# Altium schematic sheet fpga_gpif.SchDoc
size A3
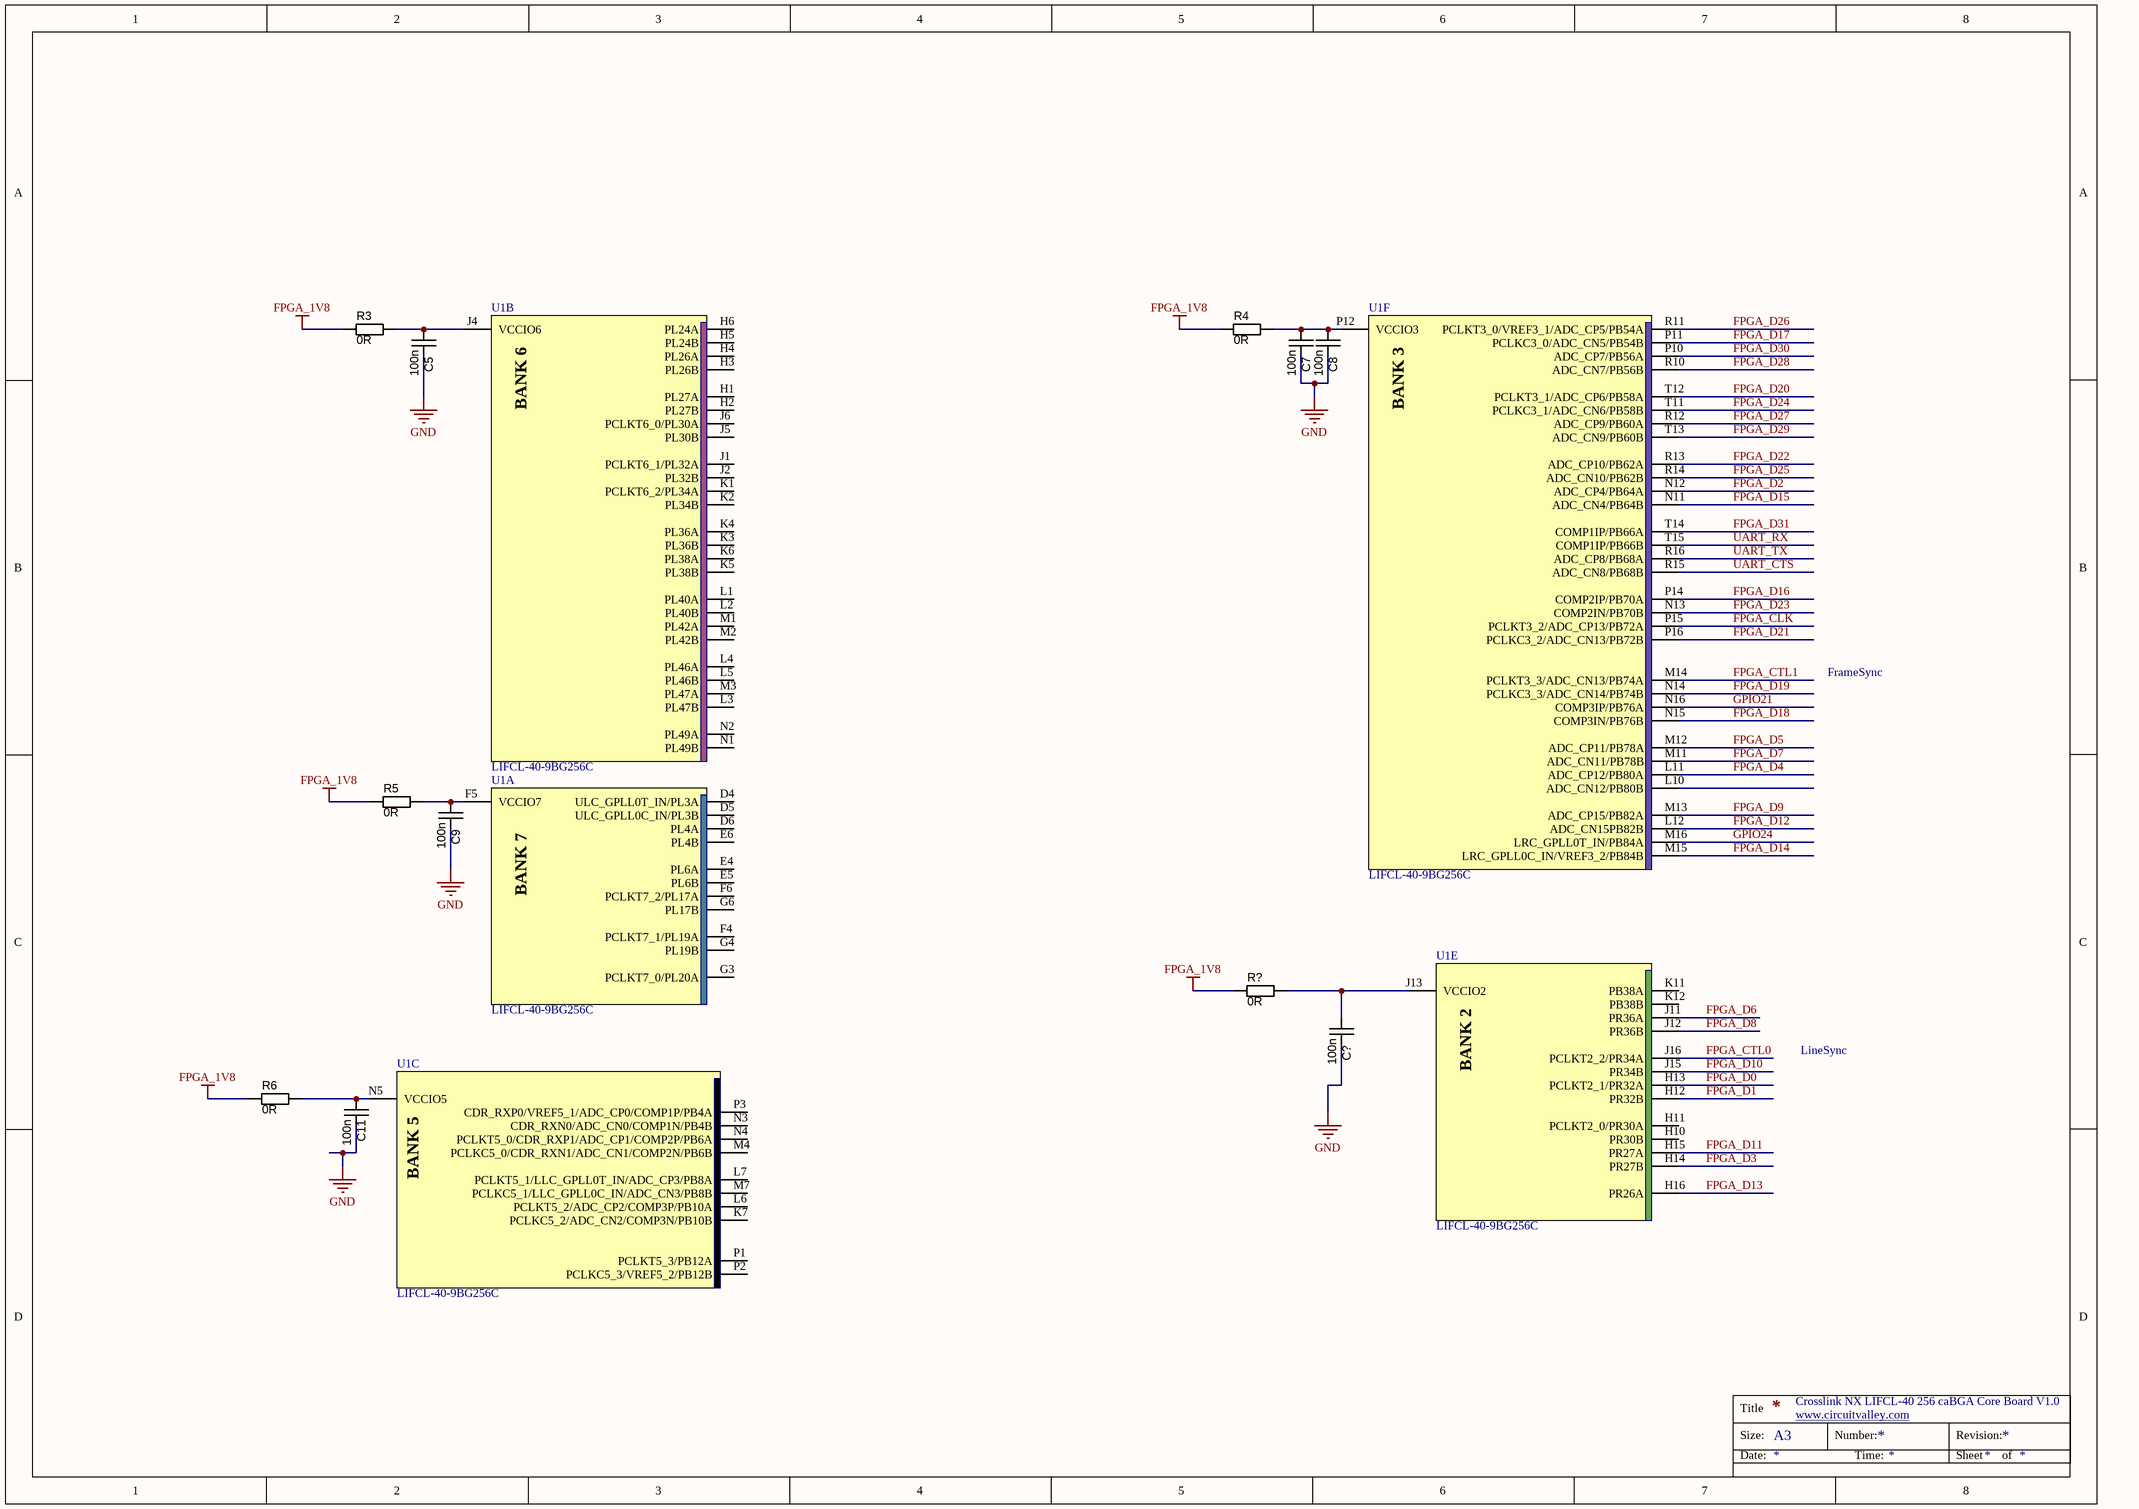
[diagram p0: fpga_gpif.SchDoc]

## Parts
C5  100n  [CAPC1005N]
C7  100n  [CAPC1005N]
C8  100n  [CAPC1005N]
C9  100n  [CAPC1005N]
C11  100n  [CAPC1005N]
C?  100n  [CAPC1005N]
R3  value 0R  [RESC1005N]  (hidden comment: Thick Film)
R4  value 0R  [RESC1005N]  (hidden comment: Thick Film)
R5  value 0R  [RESC1005N]  (hidden comment: Thick Film)
R6  value 0R  [RESC1005N]  (hidden comment: Thick Film)
R?  value 0R  [RESC1005N]  (hidden comment: Thick Film)
U1  LIFCL-40-9BG256C  [Lattice_256_CABGA]  (parts A,B,C,E,F of 14)

## Nets
FPGA_1V8: R3.1 R4.1 R5.1 R6.1 R?.1
GND: C5.1 C7.1 C8.1 C9.1 C11.1 C?.1
FPGA_CLK: U1.P15(PCLKT3_2/ADC_CP13/PB72A)
FPGA_CTL0: U1.J16(PCLKT2_2/PR34A)
FPGA_CTL1: U1.M14(PCLKT3_3/ADC_CN13/PB74A)
FPGA_D0: U1.H13(PCLKT2_1/PR32A)
FPGA_D1: U1.H12(PR32B)
FPGA_D2: U1.N12(ADC_CP4/PB64A)
FPGA_D3: U1.H14(PR27B)
FPGA_D4: U1.L11(ADC_CP12/PB80A)
FPGA_D5: U1.M12(ADC_CP11/PB78A)
FPGA_D6: U1.J11(PR36A)
FPGA_D7: U1.M11(ADC_CN11/PB78B)
FPGA_D8: U1.J12(PR36B)
FPGA_D9: U1.M13(ADC_CP15/PB82A)
FPGA_D10: U1.J15(PR34B)
FPGA_D11: U1.H15(PR27A)
FPGA_D12: U1.L12(ADC_CN15PB82B)
FPGA_D13: U1.H16(PR26A)
FPGA_D14: U1.M15(LRC_GPLL0C_IN/VREF3_2/PB84B)
FPGA_D15: U1.N11(ADC_CN4/PB64B)
FPGA_D16: U1.P14(COMP2IP/PB70A)
FPGA_D17: U1.P11(PCLKC3_0/ADC_CN5/PB54B)
FPGA_D18: U1.N15(COMP3IN/PB76B)
FPGA_D19: U1.N14(PCLKC3_3/ADC_CN14/PB74B)
FPGA_D20: U1.T12(PCLKT3_1/ADC_CP6/PB58A)
FPGA_D21: U1.P16(PCLKC3_2/ADC_CN13/PB72B)
FPGA_D22: U1.R13(ADC_CP10/PB62A)
FPGA_D23: U1.N13(COMP2IN/PB70B)
FPGA_D24: U1.T11(PCLKC3_1/ADC_CN6/PB58B)
FPGA_D25: U1.R14(ADC_CN10/PB62B)
FPGA_D26: U1.R11(PCLKT3_0/VREF3_1/ADC_CP5/PB54A)
FPGA_D27: U1.R12(ADC_CP9/PB60A)
FPGA_D28: U1.R10(ADC_CN7/PB56B)
FPGA_D29: U1.T13(ADC_CN9/PB60B)
FPGA_D30: U1.P10(ADC_CP7/PB56A)
FPGA_D31: U1.T14(COMP1IP/PB66A)
GPIO21: U1.N16(COMP3IP/PB76A)
GPIO24: U1.M16(LRC_GPLL0T_IN/PB84A)
UART_CTS: U1.R15(ADC_CN8/PB68B)
UART_RX: U1.T15(COMP1IP/PB66B)
UART_TX: U1.R16(ADC_CP8/PB68A)
NetC5_2: C5.2 R3.2 U1.J4(VCCIO6)
NetC7_2: C7.2 C8.2 R4.2 U1.P12(VCCIO3)
NetC9_2: C9.2 R5.2 U1.F5(VCCIO7)
NetC11_2: C11.2 R6.2 U1.N5(VCCIO5)
NetC?_2: C?.2 R?.2 U1.J13(VCCIO2)

Not connected (* = marked no-connect by the designer): U1 D4(ULC_GPLL0T_IN/PL3A) D5(ULC_GPLL0C_IN/PL3B) D6(PL4A) E4(PL6A) E5(PL6B) E6(PL4B) F4(PCLKT7_1/PL19A) F6(PCLKT7_2/PL17A) G3(PCLKT7_0/PL20A) G4(PL19B) G6(PL17B) H1(PL27A) H2(PL27B) H3(PL26B) H4(PL26A) H5(PL24B) H6(PL24A) H10(PR30B) H11(PCLKT2_0/PR30A) J1(PCLKT6_1/PL32A) J2(PL32B) J5(PL30B) J6(PCLKT6_0/PL30A) K1(PCLKT6_2/PL34A) K2(PL34B) K3(PL36B) K4(PL36A) K5(PL38B) K6(PL38A) K7(PCLKC5_2/ADC_CN2/COMP3N/PB10B) K11(PB38A) K12(PB38B) L1(PL40A) L2(PL40B) L3(PL47B) L4(PL46A) L5(PL46B) L6(PCLKT5_2/ADC_CP2/COMP3P/PB10A) L7(PCLKT5_1/LLC_GPLL0T_IN/ADC_CP3/PB8A) L10(ADC_CN12/PB80B) M1(PL42A) M2(PL42B) M3(PL47A) M4(PCLKC5_0/CDR_RXN1/ADC_CN1/COMP2N/PB6B) M7(PCLKC5_1/LLC_GPLL0C_IN/ADC_CN3/PB8B) N1(PL49B) N2(PL49A) N3(CDR_RXN0/ADC_CN0/COMP1N/PB4B) N4(PCLKT5_0/CDR_RXP1/ADC_CP1/COMP2P/PB6A) P1(PCLKT5_3/PB12A) P2(PCLKC5_3/VREF5_2/PB12B) P3(CDR_RXP0/VREF5_1/ADC_CP0/COMP1P/PB4A)

## Notes on the sheet
- FrameSync
- LineSync
- Crosslink NX LIFCL-40 256 caBGA Core Board V1.0
- www.circuitvalley.com <http://www.circuitvalley.com>
- Title
- Size:
- Date:
- A3
- Number:
- Time:
- Revision:
- Sheet
- of
- (in symbol LIFCL-40-9BG256C, part A) BANK 7
- (in symbol LIFCL-40-9BG256C, part B) BANK 6
- (in symbol LIFCL-40-9BG256C, part C) BANK 5
- (in symbol LIFCL-40-9BG256C, part E) BANK 2
- (in symbol LIFCL-40-9BG256C, part F) BANK 3

## Library data of the parts
C5 C7-C9 C11 C? = CAPC_10n_0402_16V_10%: Capacitor SMD Cer 10nF 10% 16V X7R 0402; Manufacturer 1: AVX Corporation; Manufacturer Part Number 1: 0402YC103KAT2A; Ratings: 16V; X7R; Tolerance: ±10%; Operating Temperature: -55°C ~ 125°C; Package / Case: 0402 (1005 Metric); Size / Dimension: 0.039" L x 0.020" W (1.00mm x 0.50mm); Manufacturer 2: Yageo; Manufacturer Part Number 2: CC0402KRX7R7BB103; Supplier 1: Digi-Key; Supplier Part Number 1: 478-1114-1-ND; ComponentLink1URL: http://www.avx.com/docs/Catalogs/cx7r.pdf; ComponentLink1Description: http://www.avx.com/docs/Catalogs/cx7r.pdf; Supplier 2: Digi-Key; Supplier Part Number 2: 311-1042-1-ND; ComponentLink2URL: http://www.yageo.com/documents/recent/UPY-GPHC_X7R_6.3V-to-50V_8.pdf; ComponentLink2Description: http://www.yageo.com/documents/recent/UPY-GPHC_X7R_6.3V-to-50V_8.pdf; Value: 100n
R3-R6 R? = RES_3K3_0402_5%: Resistor SMD chip 3.3k Ohm 0.063W 5% 0402; Manufacturer 1: Yageo; Manufacturer Part Number 1: RC0402JR-073K3L; Ratings: 1/16 W; Package / Case: 0402 (1005 metric); Tolerance: ±5%; Material: Thick Film; Supplier 1: Digi-Key; Supplier Part Number 1: 311-3.3KJRCT-ND; ComponentLink1URL: http://www.yageo.com/documents/recent/PYu-RC0402_51_RoHS_L_6.pdf; ComponentLink1Description: http://www.yageo.com/documents/recent/PYu-RC0402_51_RoHS_L_6.pdf
U1 = LIFCL-40-9BG256C: FPGA CorsslinkNX  LIFCL-40-9BG256C